# EAGLE design axiom_beta_smart_power_adapter_v0.1_r1.1 (EAGLE 7.7.0)
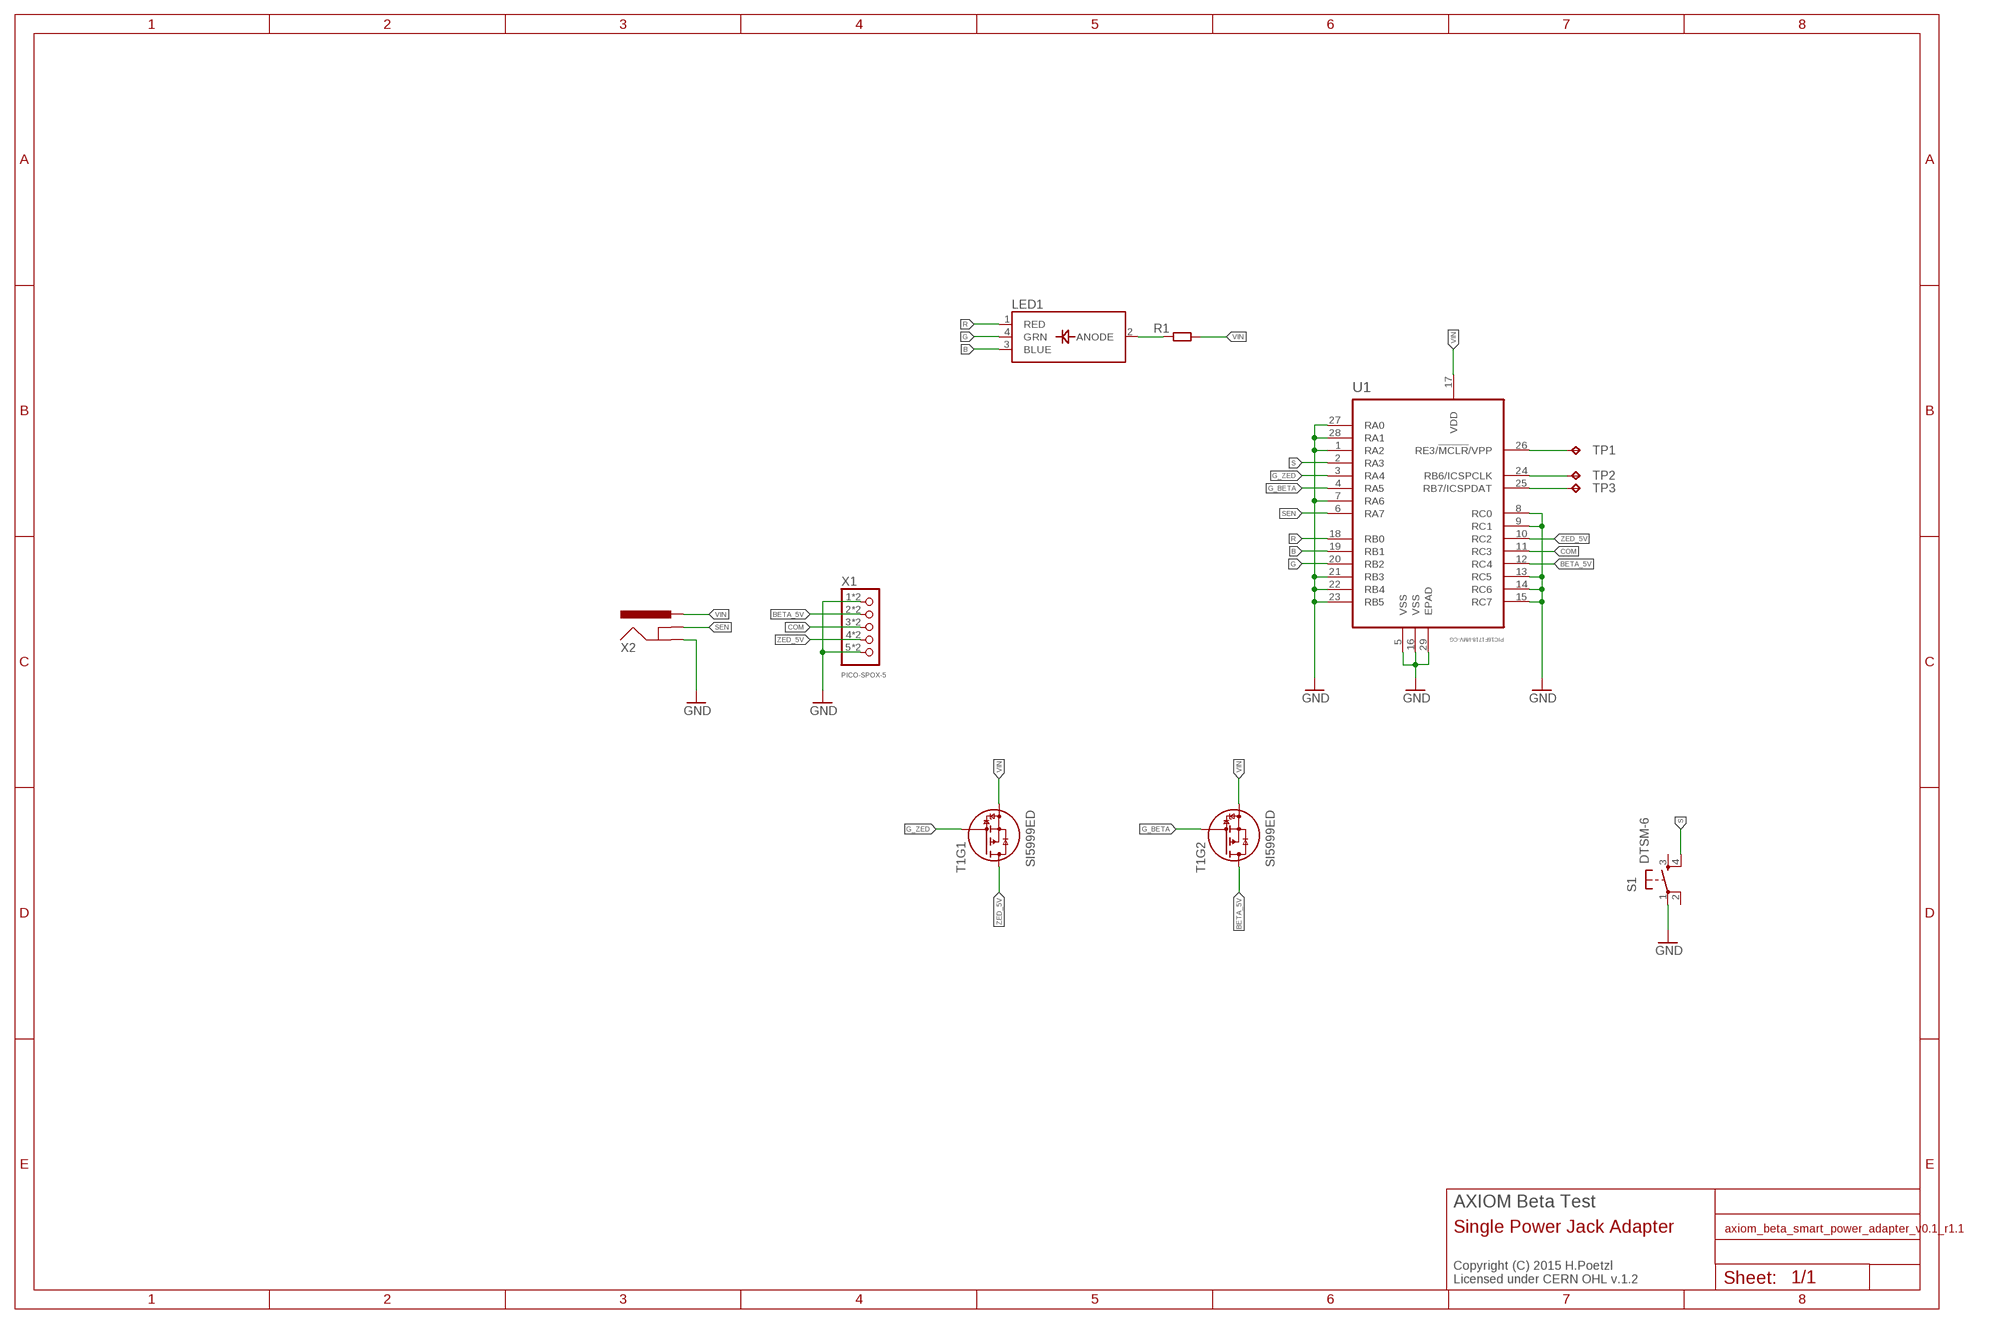
[diagram p0: schematic, sheet 1]

## Parts
LED1  LED_RGB_PLCC4  [RGBLED_PLCC4]
R1  R0402-C  [0402-C]
S1  DTSM-6  [3X4MM]
T1  SI5999ED  [PPAK-CHIPFET-DUAL]
TP1  TPTP07R  [TP07R]
TP2  TPTP07R  [TP07R]
TP3  TPTP07R  [TP07R]
U1  PIC16F1718-I/MV-CG  [QFN40P400X400X55-29N-CGND]
X1  PICO-SPOX-5  [PICO-SPOX-5]
X2  POWER_JACKPTH_SLOT  [POWER_JACK_PTH_SLOT]

## Nets
B: LED1.3(BLUE) U1.19(RB1)
BETA_5V: T1.5(D) T1.6(D) T1.EP56(D) U1.12(RC4) X1.2 X1.2A
COM: U1.11(RC3) X1.3 X1.3A
G: LED1.4(GRN) U1.20(RB2)
G_BETA: T1.4(G) U1.4(RA5)
G_ZED: T1.2(G) U1.3(RA4)
GND: S1.1 U1.1(RA2) U1.5(VSS) U1.7(RA6) U1.8(RC0) U1.9(RC1) U1.13(RC5) U1.14(RC6) U1.15(RC7) U1.16(VSS) U1.21(RB3) U1.22(RB4) U1.23(RB5) U1.27(RA0) U1.28(RA1) U1.29(EPAD) X1.1 X1.1A X1.5 X1.5A X2.GND
N$7: LED1.2(ANODE) R1.1
N$10: TP1.TP U1.26(RE3/!MCLR!/VPP)
N$11: TP2.TP U1.24(RB6/ICSPCLK)
N$12: TP3.TP U1.25(RB7/ICSPDAT)
R: LED1.1(RED) U1.18(RB0)
S: S1.4 U1.2(RA3)
SEN: U1.6(RA7) X2.SHUNT(GNDBREAK)
VIN: R1.2 T1.1(S) T1.3(S) U1.17(VDD) X2.PWR
ZED_5V: T1.7(D) T1.8(D) T1.EP78(D) U1.10(RC2) X1.4 X1.4A
Unconnected: S1.2 S1.3

## Notes on the sheet
- AXIOM Beta Test
- Single Power Jack Adapter
- Copyright (C) 2015 H.Poetzl
  Licensed under CERN OHL v.1.2

## Library data of the parts
LED1 = microbuilder:LED_RGB_PLCC4: RGB LED - PLCC4 Cree 20mA Common Anode Digikey: CLV1A-FKB-CJ1M1F1BB7R4S3CT-ND Red: 2.6V Vf, 550mcd Green: 3.2V Vf, 850mcd Blue: 3.2V Vf, 320mcd
R1 = generic-rcl:R
S1 = switch:DTSM-6
T1 = transistor:SI5999ED
TP1-TP3 = testpad:TP: Test pad
U1 = pic16f1718:PIC16F1718: MCU, 8BIT, 14K FLASH, 28UQFN
X1 = pico-spox:PICO-SPOX-5
X2 = power_jack:POWER_JACK: RASM712PX Right Angle SMT Mount DC Power Jack, pin size 0.100"(2.5mm), with locating post Switchcraft.com

## Net classes
1 LVDS: width 0.152 mm, drill 0.254 mm, clearance 0.152 mm

## Board
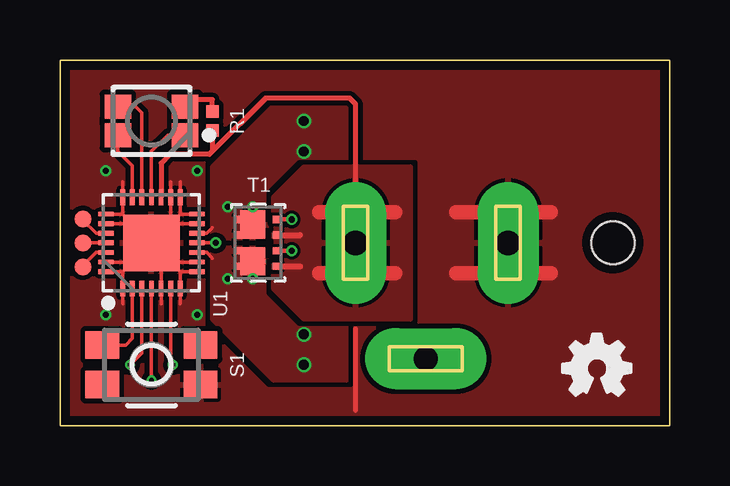
[diagram p1: board, top side]
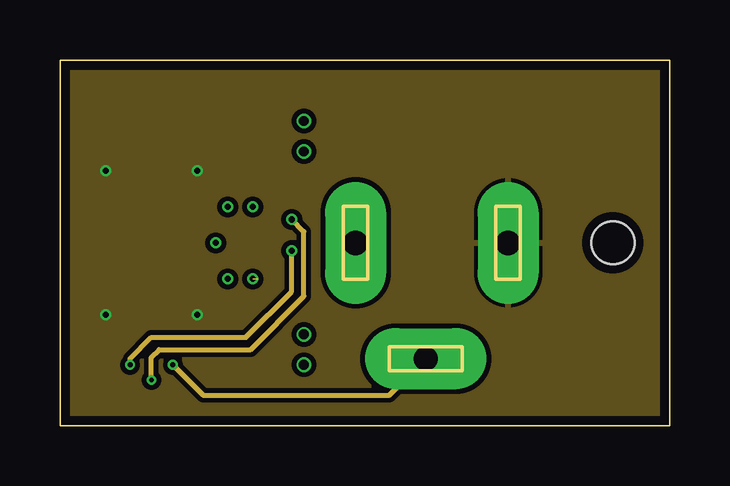
[diagram p2: board, inner layer Route2]
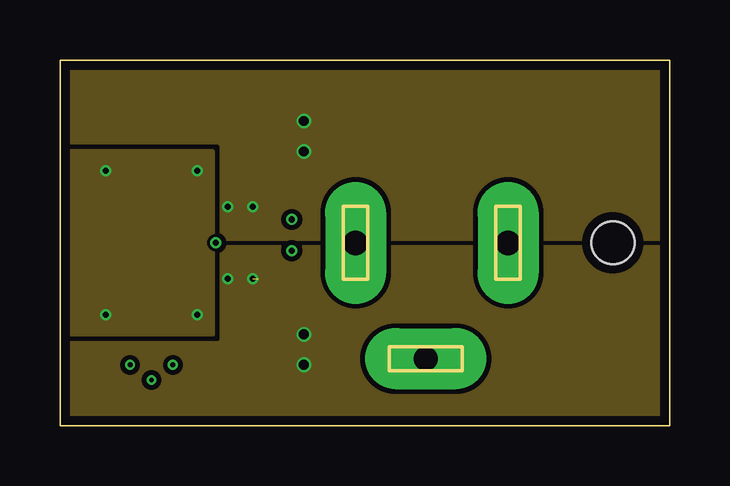
[diagram p3: board, inner layer Route15]
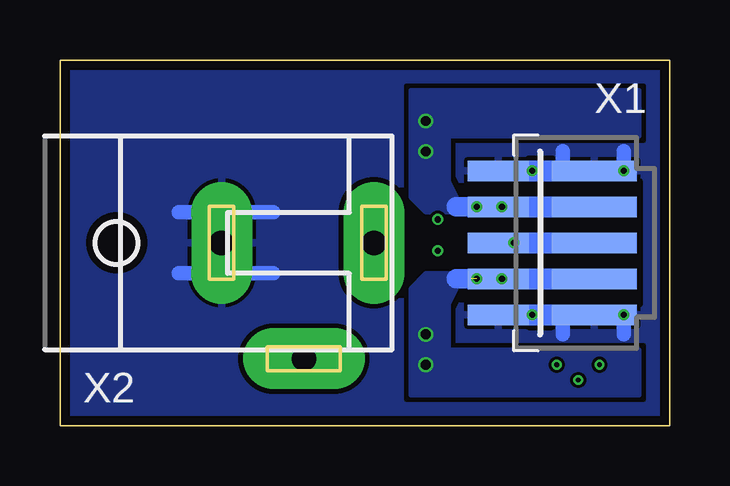
[diagram p4: board, bottom side, seen from below]

Size 25.4 x 15.24 mm. Coordinates in mm from the lower left corner, seen from the top.
Outline: 25.4,0 25.4,15.24 0,15.24 0,0 25.4,0
Copper layers (1*2*15*16): Top 0.035559375mm / dielectric 0.17018125mm / Route2 0.01778125mm / dielectric 47mil / Route15 0.01778125mm / dielectric 0.17018125mm / Bottom 0.035559375mm
Design rules "OSHPark-4layer-tuned *": minimum track width 5mil, minimum drill 10mil, track to track 5mil, track to pad 5mil, pad to pad 5mil, via to via 5mil, smd to smd 5mil, copper to edge 15mil, drill to drill 6mil, minimum pad ring 4mil, minimum via ring 4mil, stop-mask expansion 2mil, vias tented up to drill 25mil, thermal gap 6mil
tRestrict: area 1.7,6.3 to 2.3,8.9; area 5.3,6.3 to 6,8.9; area 2.5,9.1 to 5.1,9.8; area 2.5,5.5 to 5.1,6.1; area 8.9,6.3 to 9.1,6.9

### Footprints (pad centres in the part's own frame; a part is rotated, then mirrored left to right if it is on the bottom)
RGBLED_PLCC4 = smd 1.1 x 1: 1 -1.4,0.6; 2 -1.4,-0.6; 3 1.4,-0.6; 4 1.4,0.6
0402-C = smd 0.52 x 0.52: 1 -0.4,0; 2 0.4,0
3X4MM = smd 1.4 x 1.15: 1 -2.05,0.825; 2 2.05,0.825; 3 -2.05,-0.825; 4 2.05,-0.825
PPAK-CHIPFET-DUAL = smd 0.3 x 0.35: 1 -0.975,-0.775; 2 -0.325,-0.775; 3 0.325,-0.775; 4 0.975,-0.775; 5 0.975,0.775; 6 0.325,0.775; 7 -0.325,0.775; 8 -0.975,0.775 | smd 1.175 x 1.05: EP56 0.762,0.225; EP78 -0.762,0.225
TP07R = smd 0.7 x 0.7: TP 0,0
QFN40P400X400X55-29N-CGND = smd 0.65 x 0.2: 1 -1.9,1.2; 2 -1.9,0.8; 3 -1.9,0.4; 4 -1.9,0; 5 -1.9,-0.4; 6 -1.9,-0.8; 7 -1.9,-1.2; 15 1.9,-1.2; 16 1.9,-0.8; 17 1.9,-0.4; 18 1.9,0; 19 1.9,0.4; 20 1.9,0.8; 21 1.9,1.2 | smd 0.2 x 0.65: 8 -1.2,-1.9; 9 -0.8,-1.9; 10 -0.4,-1.9; 11 0,-1.9; 12 0.4,-1.9; 13 0.8,-1.9; 14 1.2,-1.9; 22 1.2,1.9; 23 0.8,1.9; 24 0.4,1.9; 25 0,1.9; 26 -0.4,1.9; 27 -0.8,1.9; 28 -1.2,1.9 | smd 2.35 x 2.35: 29 0,0
PICO-SPOX-5 = smd 0.85 x 2.55: 1 -3,-6.5; 2 -1.5,-6.5; 3 0,-6.5; 4 1.5,-6.5; 5 3,-6.5 | smd 0.85 x 3.55: 1A -3,-2.5; 2A -1.5,-2.5; 3A 0,-2.5; 4A 1.5,-2.5; 5A 3,-2.5
POWER_JACK_PTH_SLOT = drill 1.016 pad 2.54 long: GND 0,7.366; PWR 0,13.716; SHUNT 4.826,10.795 | hole 1.778: 0,2.994

### Placement (x,y rotation side)
LED1  3.81,12.7 180 top
LOGO1  OSHW_LOGO_FILLX0100-NT  [OSHW_FILLX100_NOTEXT]  20.95,1.27 0 top
R1  6.35,12.7 270 top
S1  3.81,2.54 180 top
T1  8.26,7.62 90 top
TP1  0.95,6.62 0 top
TP2  0.95,8.62 0 top
TP3  0.95,7.62 0 top
U1  3.81,7.62 90 top
X1  0.64,7.62 270 bottom
X2  26.04,7.62 270 bottom

### Tracks (layer width: path | path; a pad name or v marks a point on that pad's centre or on a via)
B
  Top 0.152: U1.19 3.41,13.05 3.16,13.3 LED1.3
BETA_5V  (via drill 0.25, 0.41)
  Top 0.152: U1.12 6.12,8.02 6.35,8.26 | T1.6 8.03,7.95 T1.EP56 8.03,8.6 T1.5
  Bottom 0.813: X1.2A X1.2 8.89,9.12
  other vias: 6.99,9.12 8.03,9.12 10.16,12.7 10.16,11.43
  pour Top (isolate 0.203, rank 2): 8.89,7.82 8.89,9.53 10.16,10.79 11.94,10.79 11.94,13.34 8.89,13.34 6.35,10.79 6.35,7.82
  pour Bottom (rank 2): 8.89,8.89 10.16,8.89 10.79,9.53 10.79,13.97 1.27,13.97 1.27,12.07 9.21,12.07 9.21,10.16 8.89,9.53
  pour Route15 (isolate 0.203, rank 3): 25.4,7.82 25.4,15.24 0,15.24 0,7.82
COM  (via drill 0.25)
  Top 0.152: U1.11 v6.49,7.62
  Bottom 0.152: X1.3A v6.49,7.62 X1.3
G
  Top 0.152: U1.20 3.01,10.83 2.41,11.43 LED1.4
G_BETA  (via drill 0.2, 0.25)
  Top 0.152: U1.4 v3.81,1.91
  Top 0.178: T1.4 v9.65,8.6
  Route2 0.203: v3.81,1.91 3.81,2.86 4.13,3.17 7.94,3.17 10.16,5.4 10.16,8.09 v9.65,8.6
G_ZED  (via drill 0.2, 0.25)
  Top 0.152: U1.3 3.41,3.03 v2.92,2.54
  Top 0.178: T1.2 v9.65,7.29
  Route2 0.203: v2.92,2.54 2.92,2.79 3.81,3.68 7.75,3.68 9.65,5.59 v9.65,7.29
GND  (via drill 0.25)
  Top 0.152: 4.61,10.16 U1.16 4.61,8.42 | U1.29 4.21,7.22 U1.5 4.21,5.08 | 2.61,10.16 U1.21 2.61,8.82 | U1.22 2.61,8.82 | 2.61,8.82 U1.29 | U1.23 3.01,8.42 U1.29 | U1.27 3.01,6.82 U1.29 | U1.28 2.61,6.42 | 2.61,6.42 U1.1 2.61,5.08 | 2.61,6.42 U1.29 | 5.01,6.42 U1.7 5.01,5.08 | U1.8 5.01,6.42 | 5.01,6.42 U1.29 | U1.9 4.61,6.82 U1.29 | U1.13 4.61,8.42 | 4.61,8.42 U1.29 | U1.14 5.01,8.82 | 5.01,8.82 U1.15 5.01,10.16 | 5.01,8.82 U1.29
  Top 0.203: 12.32,0.63 12.32,4.04
  Top 0.61: 20.45,6.35 16.51,6.35 | 20.45,8.89 16.51,8.89
  Bottom 0.61: 20.45,8.89 16.51,8.89 | 20.45,6.35 16.51,6.35 | 4.45,3.81 4.45,4.45 | 1.91,3.81 1.91,4.45 | 4.45,10.79 4.45,11.43 | 1.91,10.79 1.91,11.43
  other vias: 1.91,10.62 5.71,10.62 1.91,4.62 5.71,4.62
  pour Bottom (isolate 0.203, rank 3): 25.4,0 25.4,15.24 0,15.24 0,0
  pour Top (isolate 0.203, rank 3): 25.4,0 25.4,15.24 0,15.24 0,0
  pour Route2 (isolate 0.203, rank 3): 25.4,0 25.4,15.24 0,15.24 0,0
  pour Route15: 0,11.43 6.35,11.43 6.35,3.81 0,3.81
N$1
  cutout Bottom: 7.37,10.16 1.27,10.16 1.27,5.08 7.37,5.08
N$7
  Top 0.203: R1.1 6.35,13.59 5.5,13.59 LED1.2
N$10
  Top 0.152: U1.26 1.5,7.22 0.95,6.67 TP1.TP
N$11
  Top 0.152: U1.24 1.5,8.02 0.95,8.57 TP2.TP
N$12
  Top 0.152: U1.25 TP3.TP
R
  Top 0.152: U1.18 3.81,11.43 4.48,12.1 LED1.1
S
  Top 0.152: U1.2 3.01,3.65 2.73,3.37 S1.4
SEN  (via drill 0.2)
  Top 0.152: U1.6 4.61,2.63 v4.7,2.54
  Route2 0.203: X2.SHUNT 13.72,1.27 5.97,1.27 v4.7,2.54
VIN
  Top 0.203: X2.PWR 12.32,13.4 12.06,13.65 8.57,13.65 6.35,11.43 | 6.35,11.43 6.22,11.3 4.57,11.3 4.21,10.94 U1.17 | R1.2 6.35,11.43
  Top 0.254: T1.3 10,7.95 | T1.1 10,6.65
  Top 0.61: 13.97,6.35 10.79,6.35 | 13.97,8.89 10.79,8.89
  pour Top: 10.16,10.79 14.61,10.79 14.61,4.45 10.16,4.45 8.89,5.71 8.89,9.53
ZED_5V  (via drill 0.25, 0.41)  (1 unrouted)
  Top 0.152: U1.10 6.12,7.22 6.35,6.99 | T1.7 8.03,7.29 T1.EP78 8.03,6.65 T1.8
  Bottom 0.152: 8.44,5.94 8.26,6.12
  Bottom 0.813: X1.4A X1.4 8.89,6.12
  other vias: 6.99,6.12 8.03,6.12 10.16,3.81 10.16,2.54
  pour Top (isolate 0.203, rank 2): 8.89,7.42 8.89,5.71 10.16,4.45 11.94,4.45 11.94,1.91 8.89,1.91 6.35,4.45 6.35,7.42
  pour Bottom (rank 2): 8.89,6.35 10.16,6.35 10.79,5.71 10.79,1.27 1.27,1.27 1.27,3.17 9.21,3.17 9.21,5.08 8.89,5.71
  pour Route15 (isolate 0.203, rank 3): 25.4,0 25.4,7.42 0,7.42 0,0

### Text on the board
_tSilk: Copyright (C) 2017 / Herbert Pötzl | Licensed / under CERN / OHL v.1.2 | V0.1 / / R1.1 | AXIOM Beta / Power Adapter
_bSilk: 5V 5A
tEngrave: BETA SMART POWER / TOP SIDE V0.1 R1.0
bEngrave: BETA SMART POWER / BOTTOM SIDE V0.1 R1.0